# Altium project LimeNet-Micro_SODIMM_adapter_1v2.PrjPcb
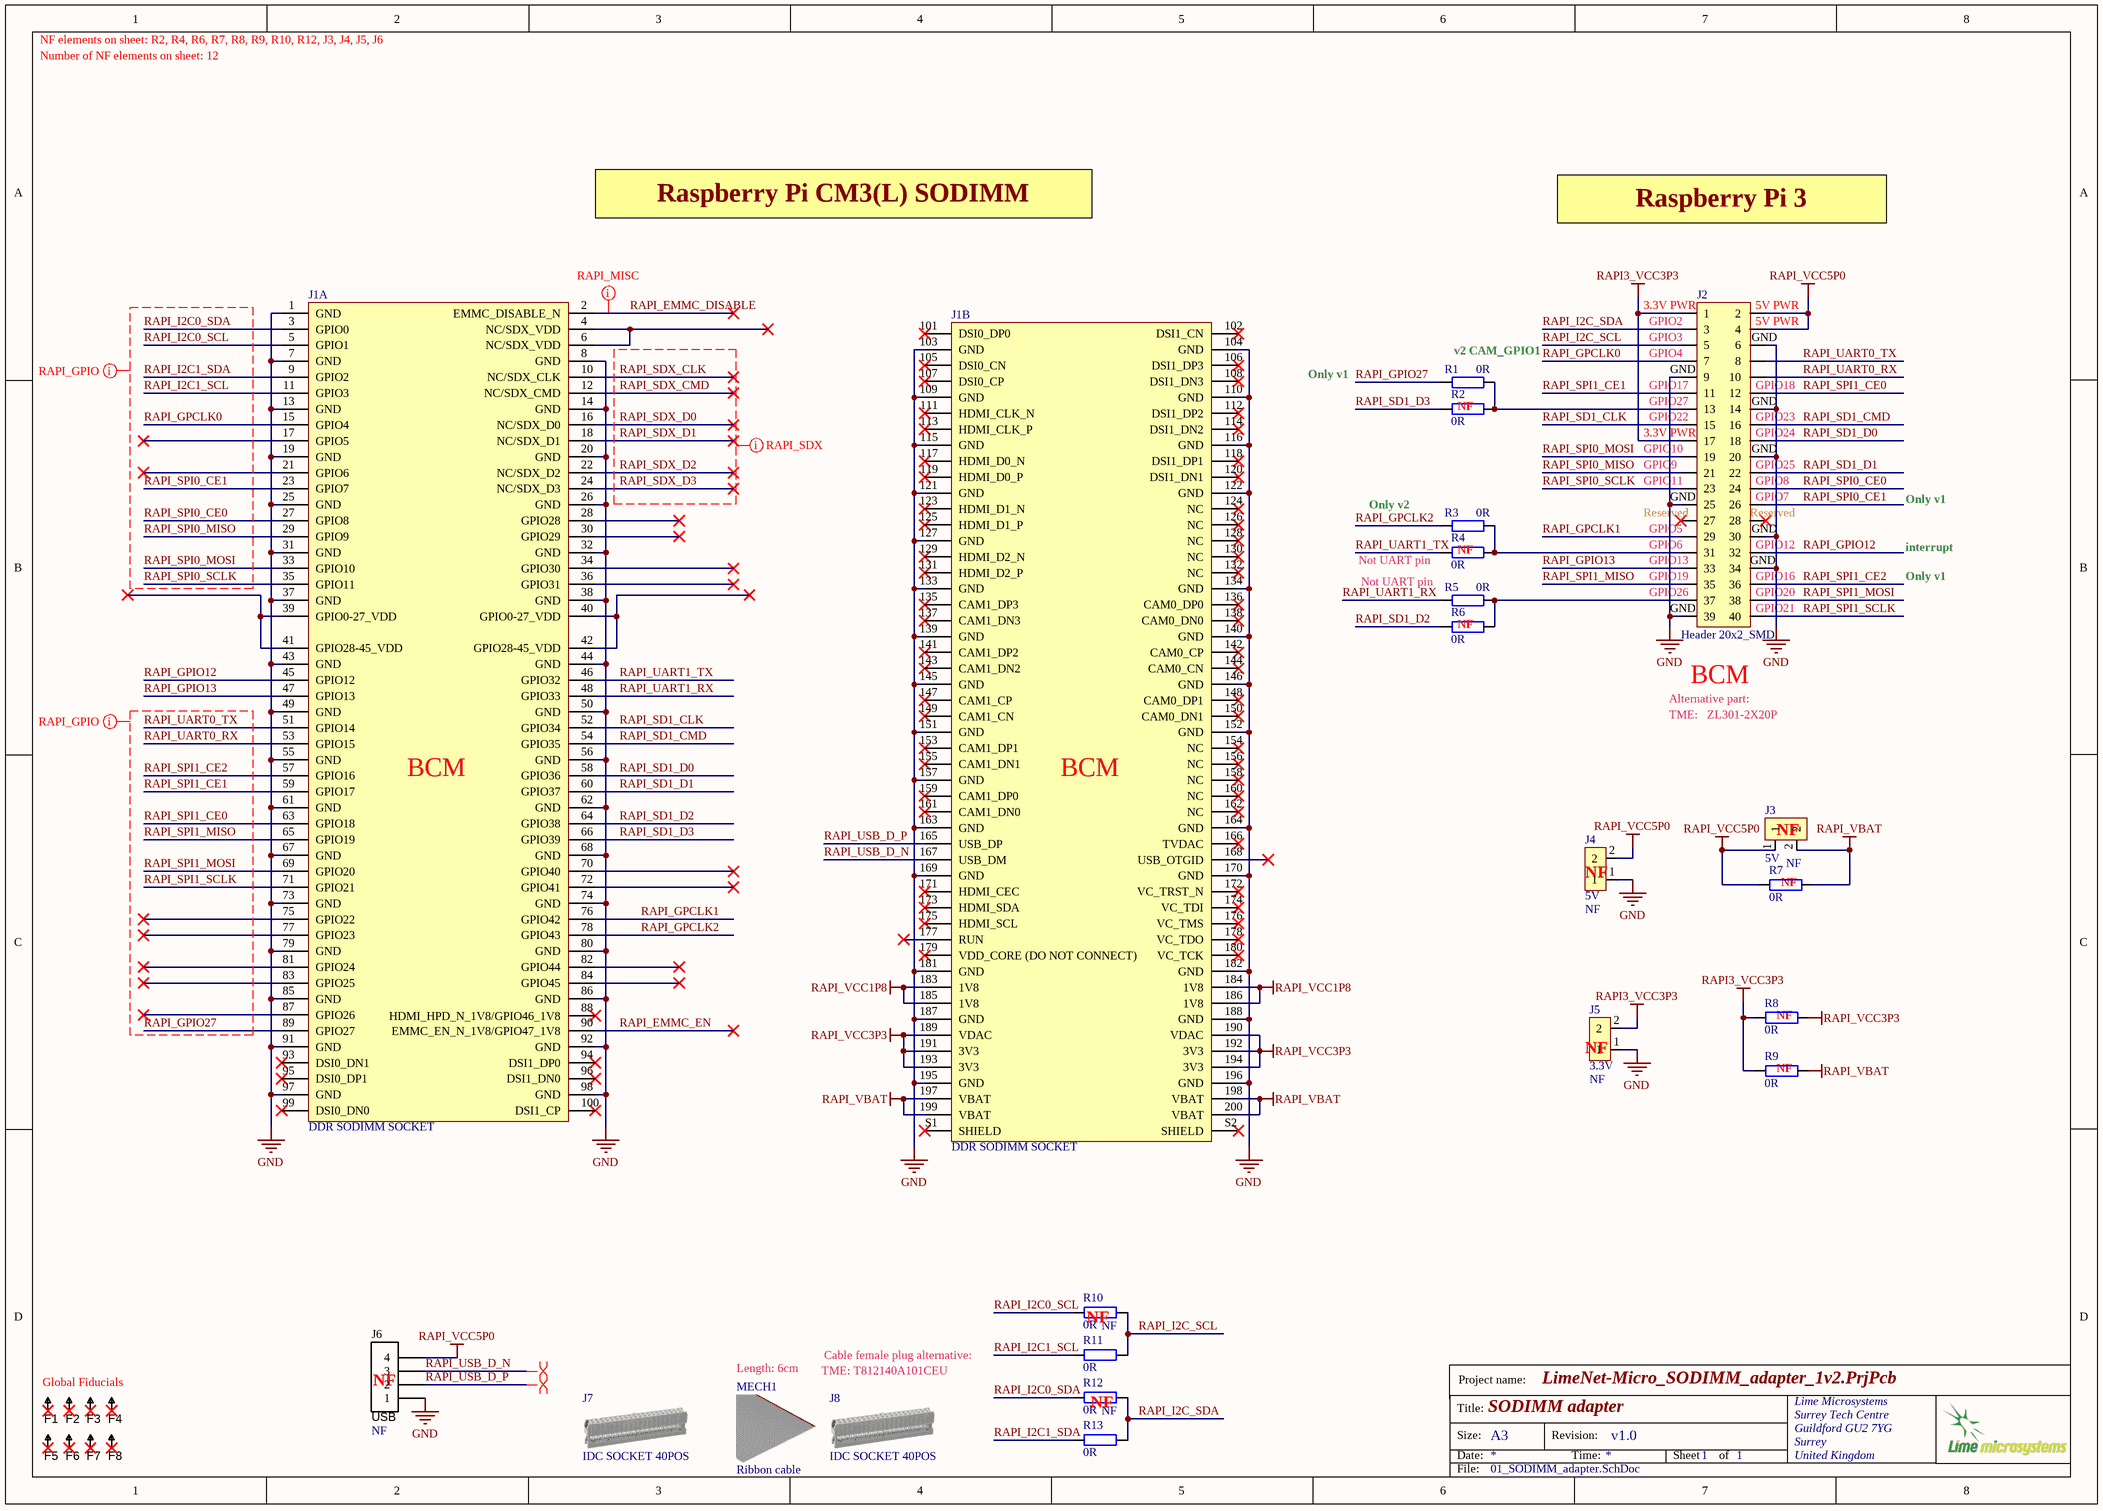
[diagram p0: 01_SODIMM_adapter.SchDoc]
1 sheet, 30 parts. Net scope: global (net labels, ports and power ports of the same name join across sheets).
Board file: LimeNet-Micro_SODIMM_adapter_1v2.PcbDoc

## Sheet 01_SODIMM_adapter.SchDoc: SODIMM adapter
size A3; Organization: Lime Microsystems; Address1: Surrey Tech Centre; Address2: Guildford GU2 7YG; Address3: Surrey; Address4: United Kingdom; Revision: v1.0; SheetNumber: 1; SheetTotal: 1

### Parts
F1  Fiducial  [Fiducial]  (value not drawn)
F2  Fiducial  [Fiducial]  (value not drawn)
F3  Fiducial  [Fiducial]  (value not drawn)
F4  Fiducial  [Fiducial]  (value not drawn)
F5  Fiducial  [Fiducial]  (value not drawn)
F6  Fiducial  [Fiducial]  (value not drawn)
F7  Fiducial  [Fiducial]  (value not drawn)
F8  Fiducial  [Fiducial]  (value not drawn)
J1  DDR SODIMM SOCKET  [SODIMM_200PIN_PCB_pads]  (parts A,B of 2)  (no BOM)
J2  Header 20x2_SMD  [Header20x2_SM_v2_flipped]
J3  5V  Assembly Info: NF  [HDR_1x2]
J4  5V  Assembly Info: NF  [HDR_1x2]
J5  3.3V  Assembly Info: NF  [HDR_1x2]
J6  USB  Assembly Info: NF  [HEADER4X1_TH]
J7  IDC SOCKET 40POS  (mechanical)
J8  IDC SOCKET 40POS  (mechanical)
MECH1  Ribbon cable  (mechanical)
R1  0R  [RES0402]
R2  0R  Assembly Info: NF  [RES0402]
R3  0R  [RES0402]
R4  0R  Assembly Info: NF  [RES0402]
R5  0R  [RES0402]
R6  0R  Assembly Info: NF  [RES0402]
R7  0R  Assembly Info: NF  [RES0805]
R8  0R  Assembly Info: NF  [RES0805]
R9  0R  Assembly Info: NF  [RES0805]
R10  0R  Assembly Info: NF  [RES0402]
R11  0R  [RES0402]
R12  0R  Assembly Info: NF  [RES0402]
R13  0R  [RES0402]

### Nets
GND: J1.1(GND) J1.7(GND) J1.8(GND) J1.13(GND) J1.14(GND) J1.19(GND) J1.20(GND) J1.25(GND) J1.26(GND) J1.31(GND) J1.32(GND) J1.37(GND) J1.38(GND) J1.43(GND) J1.44(GND) J1.49(GND) J1.50(GND) J1.55(GND) J1.56(GND) J1.61(GND) J1.62(GND) J1.67(GND) J1.68(GND) J1.73(GND) J1.74(GND) J1.79(GND) J1.80(GND) J1.85(GND) J1.86(GND) J1.91(GND) J1.92(GND) J1.97(GND) J1.98(GND) J1.103(GND) J1.104(GND) J1.109(GND) J1.110(GND) J1.115(GND) J1.116(GND) J1.121(GND) J1.122(GND) J1.127(GND) J1.133(GND) J1.134(GND) J1.139(GND) J1.140(GND) J1.145(GND) J1.146(GND) J1.151(GND) J1.152(GND) J1.157(GND) J1.163(GND) J1.164(GND) J1.169(GND) J1.170(GND) J1.181(GND) J1.182(GND) J1.187(GND) J1.188(GND) J1.195(GND) J1.196(GND) J2.6 J2.9 J2.14 J2.20 J2.25 J2.30 J2.34 J2.39 J4.1 J5.1 J6.1
RAPI3_VCC3P3: J2.1 J2.17 J5.2 R8.2 R9.2
RAPI_VBAT: J1.197(VBAT) J1.198(VBAT) J1.199(VBAT) J1.200(VBAT) J3.2 R7.1 R9.1
RAPI_VCC1P8: J1.183(1V8) J1.184(1V8) J1.185(1V8) J1.186(1V8)
RAPI_VCC3P3: J1.189(VDAC) J1.190(VDAC) J1.191(3V3) J1.192(3V3) J1.193(3V3) J1.194(3V3) R8.1
RAPI_VCC5P0: J2.2 J2.4 J3.1 J4.2 J6.4 R7.2
RAPI_EMMC_DISABLE: J1.2(EMMC_DISABLE_N)
RAPI_EMMC_EN: J1.90(EMMC_EN_N_1V8/GPIO47_1V8)
RAPI_GPCLK0: J1.15(GPIO4) J2.7
RAPI_GPCLK1: J1.76(GPIO42) J2.29
RAPI_GPCLK2: J1.78(GPIO43) R3.2
RAPI_GPIO12: J1.45(GPIO12) J2.32
RAPI_GPIO13: J1.47(GPIO13) J2.33
RAPI_GPIO27: J1.89(GPIO27) R1.2
RAPI_I2C0_SCL: J1.5(GPIO1) R10.1
RAPI_I2C0_SDA: J1.3(GPIO0) R12.1
RAPI_I2C1_SCL: J1.11(GPIO3) R11.1
RAPI_I2C1_SDA: J1.9(GPIO2) R13.1
RAPI_I2C_SCL: J2.5 R10.2 R11.2
RAPI_I2C_SDA: J2.3 R12.2 R13.2
RAPI_SD1_CLK: J1.52(GPIO34) J2.15
RAPI_SD1_CMD: J1.54(GPIO35) J2.16
RAPI_SD1_D0: J1.58(GPIO36) J2.18
RAPI_SD1_D1: J1.60(GPIO37) J2.22
RAPI_SD1_D2: J1.64(GPIO38) R6.2
RAPI_SD1_D3: J1.66(GPIO39) R2.2
RAPI_SDX_CLK: J1.10(NC/SDX_CLK)
RAPI_SDX_CMD: J1.12(NC/SDX_CMD)
RAPI_SDX_D0: J1.16(NC/SDX_D0)
RAPI_SDX_D1: J1.18(NC/SDX_D1)
RAPI_SDX_D2: J1.22(NC/SDX_D2)
RAPI_SDX_D3: J1.24(NC/SDX_D3)
RAPI_SPI0_CE0: J1.27(GPIO8) J2.24
RAPI_SPI0_CE1: J1.23(GPIO7) J2.26
RAPI_SPI0_MISO: J1.29(GPIO9) J2.21
RAPI_SPI0_MOSI: J1.33(GPIO10) J2.19
RAPI_SPI0_SCLK: J1.35(GPIO11) J2.23
RAPI_SPI1_CE0: J1.63(GPIO18) J2.12
RAPI_SPI1_CE1: J1.59(GPIO17) J2.11
RAPI_SPI1_CE2: J1.57(GPIO16) J2.36
RAPI_SPI1_MISO: J1.65(GPIO19) J2.35
RAPI_SPI1_MOSI: J1.69(GPIO20) J2.38
RAPI_SPI1_SCLK: J1.71(GPIO21) J2.40
RAPI_UART0_RX: J1.53(GPIO15) J2.10
RAPI_UART0_TX: J1.51(GPIO14) J2.8
RAPI_UART1_RX: J1.48(GPIO33) R5.2
RAPI_UART1_TX: J1.46(GPIO32) R4.2
RAPI_USB_D_N: J1.167(USB_DM) J6.3
RAPI_USB_D_P: J1.165(USB_DP) J6.2
NetJ1_4: J1.4(NC/SDX_VDD) J1.6(NC/SDX_VDD)
NetJ1_39: J1.39(GPIO0-27_VDD) J1.41(GPIO28-45_VDD)
NetJ1_40: J1.40(GPIO0-27_VDD) J1.42(GPIO28-45_VDD)
NetJ2_13: J2.13 R1.1 R2.1
NetJ2_31: J2.31 R3.1 R4.1
NetJ2_37: J2.37 R5.1 R6.1

Not connected (* = marked no-connect by the designer): F1 1*; F2 1*; F3 1*; F4 1*; F5 1*; F6 1*; F7 1*; F8 1*; J1 17(GPIO5)* 21(GPIO6)* 28(GPIO28)* 30(GPIO29)* 34(GPIO30)* 36(GPIO31)* 70(GPIO40)* 72(GPIO41)* 75(GPIO22)* 77(GPIO23)* 81(GPIO24)* 82(GPIO44)* 83(GPIO25)* 84(GPIO45)* 87(GPIO26)* 88(HDMI_HPD_N_1V8/GPIO46_1V8)* 93(DSI0_DN1)* 94(DSI1_DP0)* 95(DSI0_DP1)* 96(DSI1_DN0)* 99(DSI0_DN0)* 100(DSI1_CP)* 101(DSI0_DP0)* 102(DSI1_CN)* 105(DSI0_CN)* 106(DSI1_DP3)* 107(DSI0_CP)* 108(DSI1_DN3)* 111(HDMI_CLK_N)* 112(DSI1_DP2)* 113(HDMI_CLK_P)* 114(DSI1_DN2)* 117(HDMI_D0_N)* 118(DSI1_DP1)* 119(HDMI_D0_P)* 120(DSI1_DN1)* 123(HDMI_D1_N)* 124(NC)* 125(HDMI_D1_P)* 126(NC)* 128(NC)* 129(HDMI_D2_N)* 130(NC)* 131(HDMI_D2_P)* 132(NC)* 135(CAM1_DP3)* 136(CAM0_DP0)* 137(CAM1_DN3)* 138(CAM0_DN0)* 141(CAM1_DP2)* 142(CAM0_CP)* 143(CAM1_DN2)* 144(CAM0_CN)* 147(CAM1_CP)* 148(CAM0_DP1)* 149(CAM1_CN)* 150(CAM0_DN1)* 153(CAM1_DP1)* 154(NC)* 155(CAM1_DN1)* 156(NC)* 158(NC)* 159(CAM1_DP0)* 160(NC)* 161(CAM1_DN0)* 162(NC)* 166(TVDAC)* 168(USB_OTGID)* 171(HDMI_CEC)* 172(VC_TRST_N)* 173(HDMI_SDA)* 174(VC_TDI)* 175(HDMI_SCL)* 176(VC_TMS)* 177(RUN)* 178(VC_TDO)* 179(VDD_CORE_(DO_NOT_CONNECT))* 180(VC_TCK)* S1(SHIELD)* S2(SHIELD)*; J2 27* 28*

### Layout directives
net class RAPI_GPIO: RAPI_GPCLK0, RAPI_GPIO27, RAPI_I2C0_SCL, RAPI_I2C0_SDA, RAPI_I2C1_SCL, RAPI_I2C1_SDA, RAPI_SPI0_CE0, RAPI_SPI0_CE1, RAPI_SPI0_MISO, RAPI_SPI0_MOSI, RAPI_SPI0_SCLK, RAPI_SPI1_CE0, RAPI_SPI1_CE1, RAPI_SPI1_CE2, RAPI_SPI1_MISO, RAPI_SPI1_MOSI, RAPI_SPI1_SCLK, RAPI_UART0_RX, RAPI_UART0_TX
net class RAPI_SDX: RAPI_SDX_CLK, RAPI_SDX_CMD, RAPI_SDX_D0, RAPI_SDX_D1, RAPI_SDX_D2, RAPI_SDX_D3
net class RAPI_MISC: RAPI_EMMC_DISABLE
differential pair; net class RAPI_USB: RAPI_USB_D_N, RAPI_USB_D_P

### Notes on the sheet
- NF elements on sheet: R2, R4, R6, R7, R8, R9, R10, R12, J3, J4, J5, J6
- Number of NF elements on sheet: 12
- Raspberry Pi CM3(L) SODIMM
- Raspberry Pi 3
- (near J2) 3.3V PWR
- (near J2) 5V PWR
- Only v1
- (near R1) v2 CAM_GPIO1
- (near J2) GPIO2
- (near J2) GPIO3
- (near J2) GPIO4
- (near J2) GND
- (near J2) GPIO10
- (near J2) GPIO17
- (near J2) GPIO27
- (near J2) GPIO22
- (near J2) GPIO18
- (near J2) GPIO23
- (near J2) GPIO24
- Only v2
- (near J2) GPIO9
- (near J2) GPIO11
- (near J2) Reserved
- (near J2) GPIO25
- (near J2) GPIO8
- (near J2) GPIO7
- (near R4) Not UART pin
- Not UART pin
- (near J2) GPIO5
- (near J2) GPIO6
- (near J2) GPIO13
- (near J2) GPIO19
- (near J2) GPIO12
- (near J2) GPIO16
- interrupt
- (near J2) GPIO26
- (near J2) GPIO20
- (near J2) GPIO21
- TME:   ZL301-2X20P
- Alternative part:
- (near J2) BCM
- (near J1) BCM
- (near J3) NF
- (near J4) NF
- (near J5) NF
- (near R10) NF
- Global Fiducials
- (near J6) NF
- (near MECH1) Length: 6cm
- (near J8) TME: T812140A101CEU
- (near J8) Cable female plug alternative:
- (near R12) NF
- Project name:
- Title:
- Size:
- Date:
- A3
- Revision:
- Time:
- Sheet
- of
- File:

### Library data of the parts
J1 = 1717254-1: Part Description: 200 Position SODIMM DDR SDRAM Socket Surface Mount, Right Angle; Manufacturer: TE Connectivity AMP Connectors; Memory Type: DDR SDRAM; Supplier 1: Digi-Key; Manufacturer Part Number 1: 1717254-1; RoHS: RoHS Compliant; Category: Connectors, Interconnects; Stock 1: 610; Pricing 1: 1=3.29, 10=3.155, 25=2.8924, 50=2.761 (USD); Packaging: Cut Tape (CT); Part Status: Active; Connector Style: SODIMM; Standards: -; Mounting Type: Surface Mount, Right Angle; Features: Board Guide, Latches; Mounting Feature: Normal, Standard - Top; Contact Finish: Gold; Contact Finish Thickness: Flash; ComponentLink1URL: http://www.te.com/commerce/DocumentDelivery/DDEController?Action=srchrtrv&DocNm=1717254&DocType=Customer+Drawing&DocLang=English; ComponentLink1Description: http://www.te.com/commerce/DocumentDelivery/DDEController?Action=srchrtrv&DocNm=1717254&DocType=Customer+Drawing&DocLang=English; Supplier Part Number 1: A111047CT-ND
J2 = Header 20x2_TH: Manufacturer: Amphenol FCI; Manufacturer Part Number 1: 95157-140LF; Current Rating: 3A; Voltage Rating: 1.5kV; Number of Positions: 40; Insulation Resistance: 5GR; Gender: Male; Connector Type: Male Pin; Pitch: 2.54mm; Contact Post Length: 4.7mm; Row Spacing: 0.1inch; Supplier 1: Digi-Key; Supplier Part Number 1: 609-2231-ND; Stock 1: 3049; Pricing 1: 1=1.5, 10=1.365, 100=1.1703, 500=0.97528, 1000=0.83595, 5000=0.74121, 10000=0.72449 (USD); Mount: Surface Mount; Contact Plating: Gold; Contact Material: Bronze; Color: Black; Housing Color: Black; Housing Material: Thermoplastic; Min Operating Temperature: -65°C; Max Operating Temperature: 125°C; Number of Rows: 2; Contact Gender: Male; Package Quantity: 100; Packaging: Bulk; Termination: SMD/SMT; Number of Contacts: 40; Max Voltage Rating (AC): 1.5kV; Orientation: Straight; Length: 50.8mm; Contact Mating Length: 0.23inch; Depth: 4.83mm; Width: 4.83mm; Radiation Hardening: No; REACH SVHC: No SVHC; Lead Free: Lead Free; Flammability Rating: UL94 V-0; ComponentLink1URL: http://portal.fciconnect.com/Comergent/fci/drawing/95157.pdf?src-supplier=Mouser; ComponentLink1Description: http://portal.fciconnect.com/Comergent/fci/drawing/95157.pdf?src-supplier=Mouser; ComponentLink2URL: http://portal.fciconnect.com/Comergent/fci/drawing/95157.pdf?src-supplier=Avnet; ComponentLink2Description: http://portal.fciconnect.com/Comergent/fci/drawing/95157.pdf?src-supplier=Avnet; ComponentLink3URL: https://cdn.amphenol-icc.com/media/wysiwyg/files/drawing/95157.pdf?src-supplier=Digi-Key; ComponentLink3Description: https://cdn.amphenol-icc.com/media/wysiwyg/files/drawing/95157.pdf?src-supplier=Digi-Key; ComponentLink4URL: http://www.alliedelec.com/m/d/e7f216e54bb1f11c7468e99021090c40.pdf?src-supplier=Allied+Electronics; ComponentLink4Description: http://www.alliedelec.com/m/d/e7f216e54bb1f11c7468e99021090c40.pdf?src-supplier=Allied+Electronics; Part Description: *
J3-J5 = Jumper: Manufacturer Part Number 1: 961102-6404-AR; Part Description: 2 Positions Header, Unshrouded Connector 0.100" (2.54mm) Through Hole Gold; Manufacturer: 3M; Connector Type: Header, Unshrouded; Supplier 1: Digi-Key; Supplier Part Number 1: 3M9447-ND; Contact Type: Male Pin; Color: Black; Mounting Type: Through Hole; Category: Connectors, Interconnects; Contact Finish: Gold
J6 = Header4P: Header, 4-pin; Part Description: 4 Positions Header Connector 0.100" (2.54mm) Through Hole Gold; Manufacturer: Wurth Electronics Inc.; Manufacturer Part Number 1: 61300411121; Pitch - Mating: 0.100" (2.54mm); Number of Positions: 4; Number of Positions Loaded: All; Style: Board to Board or Cable; Shrouding: Unshrouded; Contact Length - Mating: 0.236" (6.00mm); Contact Length - Post: 0.118" (3.00mm); Overall Contact Length: 0.454" (11.54mm); Material Flammability Rating: UL94 V-0; Current Rating: 3A; Voltage Rating: 250V; Supplier 1: Digi-Key; Supplier Part Number 1: 732-5317-ND; RoHS: RoHS Compliant; Category: Connectors, Interconnects; Stock 1: 25204; Pricing 1: 1=0.18, 10=0.153, 25=0.1272, 50=0.106, 100=0.096, 1000=0.088 (USD); Packaging: Bulk; Part Status: Active; Connector Type: Header; Contact Type: Male Pin; Number of Rows: 1; Row Spacing - Mating: -; Mounting Type: Through Hole; Termination: Solder; Fastening Type: Push-Pull; Insulation Height: 0.100" (2.54mm); Contact Shape: Square; Contact Finish - Mating: Gold; Contact Finish Thickness - Mating: -; Contact Finish - Post: -; Contact Material: Copper Alloy; Insulation Material: Polybutylene Terephthalate (PBT); Features: -; Operating Temperature: -40°C ~ 125°C; Ingress Protection: -; Insulation Color: Black; Mated Stacking Heights: -; Contact Finish Thickness - Post: -; Applications: -; ComponentLink1URL: http://katalog.we-online.de/em/datasheet/6130xx11121.pdf; ComponentLink1Description: http://katalog.we-online.de/em/datasheet/6130xx11121.pdf
J7 J8 = AWP40-7240_IDC_socket: Manufacturer: Assmann; Manufacturer Part Number 1: AWP-40-7240-T; Part Description: 40 Position Rectangular Socket Connector IDC Gold; Number of Contacts: 40; Max Voltage Rating (AC): 250V; Max Current Rating: 1A; Contact Resistance: 30mR; Gender: Female; Pitch: 2.54mm; Supplier 1: Digi-Key; RoHS: Yes; Stock 1: 14951; Pricing 1: 1 = 0,70000, 10 = 0,65400, 25 = 0,58880, 60 = 0,52317, 120 = 0,50142, 300 = 0,45780, 540 = 0,43600, 1020 = 0,35970, 2520 = 0,32700 (USD); Mount: Cable; Contact Material: Brass,Bronze; Color: Grey; Contact Plating: Gold; Housing Material: PBT; Min Operating Temperature: -55°C; Max Operating Temperature: 105°C; Number of Rows: 2; Termination: IDT; Orientation: Right Angle; Current Rating: 1A; Voltage Rating: 250V; Lead Free: Lead Free; ComponentLink1URL: https://www.verical.com/server-webapp/html/getDatasheet?partID=469423; ComponentLink1Description: https://www.verical.com/server-webapp/html/getDatasheet?partID=469423; ComponentLink2URL: http://www.onlinecomponents.com/productFiles/mf-ASS/awpxx-724x-t-r.pdf; ComponentLink2Description: http://www.onlinecomponents.com/productFiles/mf-ASS/awpxx-724x-t-r.pdf; ComponentLink3URL: http://www.produktinfo.conrad.com/datenblaetter/725000-749999/745430-da-01-ml-PFOSTENVERBNDER__40_POLG__GRAU_de_en.pdf; ComponentLink3Description: http://www.produktinfo.conrad.com/datenblaetter/725000-749999/745430-da-01-ml-PFOSTENVERBNDER__40_POLG__GRAU_de_en.pdf; Supplier Part Number 1: HHKC40H-ND
MECH1 = RIBBON_CABLE: Manufacturer: 3M; Part Description: Flat Ribbon Cable Gray 40 Conductors 0.050" (1.27mm) Flat Cable 1.00' (304.80mm); Conductor Material: Copper; Wire/Cable Type: Flat,Round; Number of Conductors: 40; Voltage Rating: 300V; Shielding: Unshielded; Impedance: 172R; Wire/Cable Gauge: 28AWG; Pitch: 0.05inch; Cable Length: 91.44m; Cable Pitch: 1.27mm; Supplier 1: Digikey; Manufacturer Part Number 1: 3365/40-300; Stock 1: 20; Pricing 1: 1 = 7,24000, 5 = 5,99200, 10 = 5,52400, 25 = 4,95760, 50 = 4,56720, 100 = 4,19630 (USD); Mount: Cable; Case/Package: 300; Weight: 16.3lb; Color: Grey,Red; Contact Plating: Tin; Insulation Material: Polyvinyl; Min Operating Temperature: -20°C; Max Operating Temperature: 105°C; Packaging: Roll; Length: 300foot; Depth: 50.8mm; ComponentLink1URL: http://multimedia.3m.com/mws/media/22052O/3mtm-round-conductor-flat-cable-050in-3365-series-ts0080.pdf; ComponentLink1Description: http://multimedia.3m.com/mws/media/22052O/3mtm-round-conductor-flat-cable-050in-3365-series-ts0080.pdf; ComponentLink2URL: http://datasheet.octopart.com/3365/40-300-3M-datasheet-155274.pdf; ComponentLink2Description: http://datasheet.octopart.com/3365/40-300-3M-datasheet-155274.pdf; ComponentLink3URL: http://datasheet.octopart.com/3365/40-300-3M-datasheet-8453687.pdf; ComponentLink3Description: http://datasheet.octopart.com/3365/40-300-3M-datasheet-8453687.pdf; Supplier Part Number 1: 3M157807-5-ND
R1-R6 R10-R13 = Res_0402: Manufacturer: Yageo; Part Description: RES SMD 0.0OHM JUMPER 1/16W 0402; Manufacturer Part Number 1: RC0402JR-070RL; Supplier 1: Digi-Key; Supplier Part Number 1: 311-0.0JRTR-ND; Composition: Thick Film; Package / Case: 0402 (1005 Metric); Category: Resistors; Value: 0R
R7-R9 = Res_0402: Manufacturer Part Number 1: CRCW08050000Z0EA; Manufacturer: Vishay Dale; Part Description: RES SMD 0.0 OHM JUMPER 1/8W 0805; Power (Watts): 0.125W, 1/8W; Resistance (Ohms): 0.0; Tolerance: Jumper; Value: 0R; Supplier 1: Digi-Key; Supplier Part Number 1: 541-0.0ATR-ND; Package / Case: 0805 (2012 Metric); Height: 0.020" (0.50mm); Packaging: Tape & Reel (TR); Operating Temperature: -55°C ~ 155°C; Temperature Coefficient: -; RoHS: RoHS Compliant; Size / Dimension: 0.079" L x 0.049" W (2.00mm x 1.25mm); Supplier Device Package: 0805 (2012 Metric); Number of Terminations: 2; Category: Resistors; Features: Automotive AEC-Q200; Composition: Thick Film